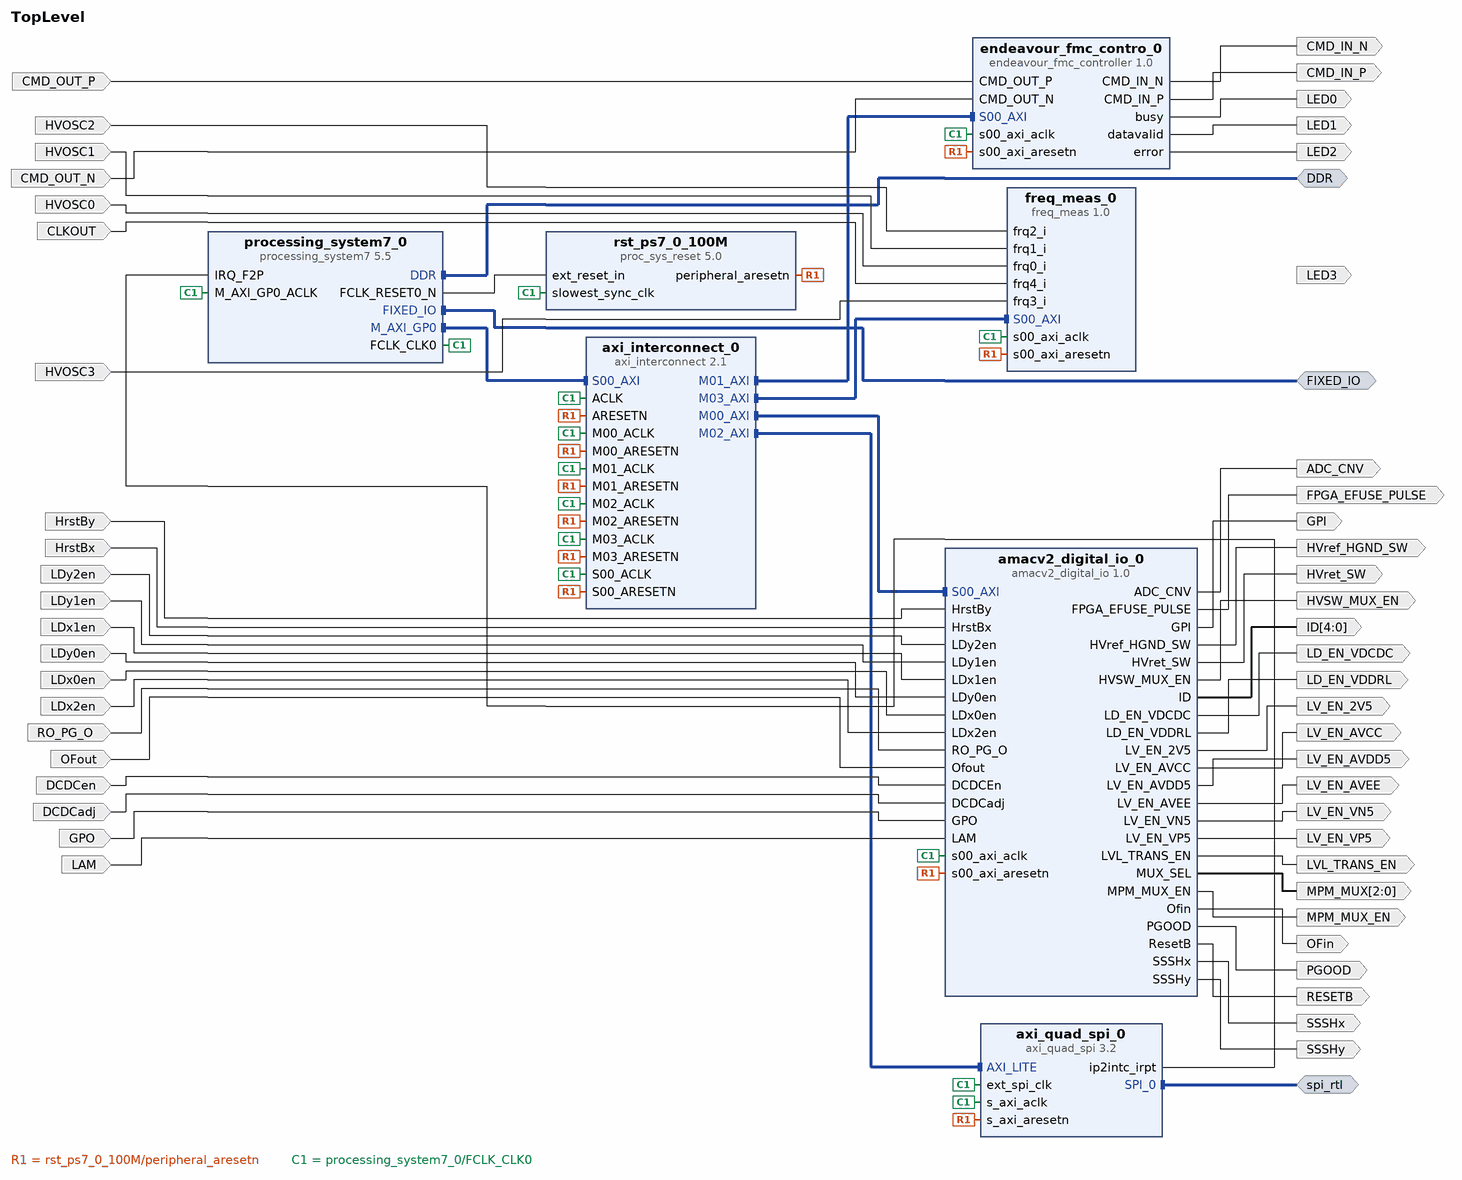
[diagram p0: block diagram of the top level]
# Vivado block design TopLevel, xc7z020clg400-1, Vivado 2018.2
create_bd_design TopLevel

create_bd_intf_port -mode Master -vlnv xilinx.com:interface:ddrx_rtl:1.0 DDR
create_bd_intf_port -mode Master -vlnv xilinx.com:display_processing_system7:fixedio_rtl:1.0 FIXED_IO
create_bd_intf_port -mode Master -vlnv xilinx.com:interface:spi_rtl:1.0 spi_rtl
create_bd_port -dir O LED3
create_bd_port -dir I HVOSC2
create_bd_port -dir I HVOSC1
create_bd_port -dir I HVOSC0
create_bd_port -dir I CLKOUT
create_bd_port -dir I HVOSC3
create_bd_port -dir I CMD_OUT_P
create_bd_port -dir I CMD_OUT_N
create_bd_port -dir O CMD_IN_P
create_bd_port -dir O CMD_IN_N
create_bd_port -dir O OFin
create_bd_port -dir O ADC_CNV
create_bd_port -dir O MPM_MUX_EN
create_bd_port -dir O -from 2 -to 0 MPM_MUX
create_bd_port -dir O HVSW_MUX_EN
create_bd_port -dir O LV_EN_AVCC
create_bd_port -dir O LV_EN_AVEE
create_bd_port -dir O LV_EN_AVDD5
create_bd_port -dir O LV_EN_VN5
create_bd_port -dir O LV_EN_VP5
create_bd_port -dir O LV_EN_2V5
create_bd_port -dir O -from 4 -to 0 ID
create_bd_port -dir O GPI
create_bd_port -dir O SSSHy
create_bd_port -dir I HrstBy
create_bd_port -dir I HrstBx
create_bd_port -dir I LDy2en
create_bd_port -dir I LDy1en
create_bd_port -dir I LDx1en
create_bd_port -dir I LDy0en
create_bd_port -dir O PGOOD
create_bd_port -dir I LDx0en
create_bd_port -dir I LDx2en
create_bd_port -dir O SSSHx
create_bd_port -dir O RESETB
create_bd_port -dir I RO_PG_O
create_bd_port -dir I OFout
create_bd_port -dir I DCDCen
create_bd_port -dir I DCDCadj
create_bd_port -dir I GPO
create_bd_port -dir I LAM
create_bd_port -dir O LD_EN_VDDRL
create_bd_port -dir O LD_EN_VDCDC
create_bd_port -dir O LVL_TRANS_EN
create_bd_port -dir O HVref_HGND_SW
create_bd_port -dir O HVret_SW
create_bd_port -dir O LED1
create_bd_port -dir O LED0
create_bd_port -dir O FPGA_EFUSE_PULSE
create_bd_port -dir O LED2

create_bd_cell -type ip -vlnv xilinx.com:ip:processing_system7:5.5 processing_system7_0
set_property -dict [list \
  CONFIG.PCW_APU_PERIPHERAL_FREQMHZ 667 \
  CONFIG.PCW_SDIO_PERIPHERAL_FREQMHZ 25 \
  CONFIG.PCW_UART_PERIPHERAL_FREQMHZ 50 \
  CONFIG.PCW_FPGA0_PERIPHERAL_FREQMHZ 100 \
  CONFIG.PCW_FPGA1_PERIPHERAL_FREQMHZ 40 \
  CONFIG.PCW_FPGA2_PERIPHERAL_FREQMHZ 33.333333 \
  CONFIG.PCW_USE_FABRIC_INTERRUPT 1 \
  CONFIG.PCW_IRQ_F2P_INTR 1 \
  CONFIG.PCW_PRESET_BANK1_VOLTAGE {LVCMOS 1.8V} \
  CONFIG.PCW_UIPARAM_DDR_PARTNO {MT41K256M16 RE-125} \
  CONFIG.PCW_QSPI_PERIPHERAL_ENABLE 1 \
  CONFIG.PCW_QSPI_QSPI_IO {MIO 1 .. 6} \
  CONFIG.PCW_QSPI_GRP_SINGLE_SS_ENABLE 1 \
  CONFIG.PCW_QSPI_GRP_SINGLE_SS_IO {MIO 1 .. 6} \
  CONFIG.PCW_SINGLE_QSPI_DATA_MODE x4 \
  CONFIG.PCW_QSPI_GRP_FBCLK_ENABLE 1 \
  CONFIG.PCW_QSPI_GRP_FBCLK_IO {MIO 8} \
  CONFIG.PCW_ENET0_PERIPHERAL_ENABLE 1 \
  CONFIG.PCW_ENET0_ENET0_IO {MIO 16 .. 27} \
  CONFIG.PCW_ENET0_GRP_MDIO_ENABLE 1 \
  CONFIG.PCW_ENET0_GRP_MDIO_IO {MIO 52 .. 53} \
  CONFIG.PCW_ENET_RESET_ENABLE 1 \
  CONFIG.PCW_ENET_RESET_SELECT {Share reset pin} \
  CONFIG.PCW_ENET0_RESET_ENABLE 0 \
  CONFIG.PCW_SD0_PERIPHERAL_ENABLE 1 \
  CONFIG.PCW_SD0_SD0_IO {MIO 40 .. 45} \
  CONFIG.PCW_SD0_GRP_CD_ENABLE 1 \
  CONFIG.PCW_SD0_GRP_CD_IO {MIO 46} \
  CONFIG.PCW_SD0_GRP_WP_ENABLE 1 \
  CONFIG.PCW_SD0_GRP_WP_IO {MIO 50} \
  CONFIG.PCW_UART1_PERIPHERAL_ENABLE 1 \
  CONFIG.PCW_UART1_UART1_IO {MIO 48 .. 49} \
  CONFIG.PCW_TTC0_PERIPHERAL_ENABLE 1 \
  CONFIG.PCW_TTC0_TTC0_IO EMIO \
  CONFIG.PCW_USB0_PERIPHERAL_ENABLE 1 \
  CONFIG.PCW_USB0_USB0_IO {MIO 28 .. 39} \
  CONFIG.PCW_USB_RESET_ENABLE 1 \
  CONFIG.PCW_USB_RESET_SELECT {Share reset pin} \
  CONFIG.PCW_USB0_RESET_ENABLE 1 \
  CONFIG.PCW_USB0_RESET_IO {MIO 7} \
  CONFIG.PCW_I2C_RESET_ENABLE 0 \
  CONFIG.PCW_GPIO_PERIPHERAL_ENABLE 1 \
  CONFIG.PCW_GPIO_MIO_GPIO_ENABLE 1 \
  CONFIG.PCW_GPIO_MIO_GPIO_IO MIO \
] [get_bd_cells processing_system7_0]
# 275 more settings of processing_system7_0 are not shown: defaults, MIO pin electricals, DDR timing, and values the tool derives
create_bd_cell -type ip -vlnv xilinx.com:ip:proc_sys_reset:5.0 rst_ps7_0_100M
create_bd_cell -type ip -vlnv xilinx.com:ip:axi_quad_spi:3.2 axi_quad_spi_0
set_property -dict [list \
  CONFIG.C_USE_STARTUP 0 \
  CONFIG.C_NUM_SS_BITS 8 \
  CONFIG.C_SCK_RATIO 4 \
  CONFIG.C_FIFO_DEPTH 16 \
  CONFIG.C_S_AXI4_ID_WIDTH 0 \
] [get_bd_cells axi_quad_spi_0]
create_bd_cell -type ip -vlnv xilinx.com:ip:axi_interconnect:2.1 axi_interconnect_0
set_property -dict {CONFIG.NUM_MI 4} [get_bd_cells axi_interconnect_0]
create_bd_cell -type ip -vlnv xilinx.com:user:amacv2_digital_io:1.0 amacv2_digital_io_0
create_bd_cell -type ip -vlnv lbl.gov:endeavour:endeavour_fmc_controller:1.0 endeavour_fmc_contro_0
create_bd_cell -type ip -vlnv user.org:user:freq_meas:1.0 freq_meas_0

# ---- connections ----

connect_bd_intf_net [get_bd_intf_pins processing_system7_0/M_AXI_GP0] [get_bd_intf_pins axi_interconnect_0/S00_AXI]
connect_bd_intf_net [get_bd_intf_pins axi_interconnect_0/M01_AXI] [get_bd_intf_pins endeavour_fmc_contro_0/S00_AXI]
connect_bd_intf_net [get_bd_intf_pins axi_interconnect_0/M02_AXI] [get_bd_intf_pins axi_quad_spi_0/AXI_LITE]
connect_bd_intf_net [get_bd_intf_pins axi_interconnect_0/M03_AXI] [get_bd_intf_pins freq_meas_0/S00_AXI]
connect_bd_intf_net [get_bd_intf_pins axi_interconnect_0/M00_AXI] [get_bd_intf_pins amacv2_digital_io_0/S00_AXI]
connect_bd_intf_net [get_bd_intf_ports DDR] [get_bd_intf_pins processing_system7_0/DDR]
connect_bd_intf_net [get_bd_intf_ports FIXED_IO] [get_bd_intf_pins processing_system7_0/FIXED_IO]
connect_bd_intf_net [get_bd_intf_ports spi_rtl] [get_bd_intf_pins axi_quad_spi_0/SPI_0]
connect_bd_net [get_bd_pins processing_system7_0/FCLK_RESET0_N] [get_bd_pins rst_ps7_0_100M/ext_reset_in]
connect_bd_net -net HVOSC2_0_1 [get_bd_ports HVOSC2] [get_bd_pins freq_meas_0/frq2_i]
connect_bd_net -net HVOSC1_0_1 [get_bd_ports HVOSC1] [get_bd_pins freq_meas_0/frq1_i]
connect_bd_net -net HVOSC0_0_1 [get_bd_ports HVOSC0] [get_bd_pins freq_meas_0/frq0_i]
connect_bd_net -net CLKOUT_0_1 [get_bd_ports CLKOUT] [get_bd_pins freq_meas_0/frq4_i]
connect_bd_net -net HVOSC3_0_1 [get_bd_ports HVOSC3] [get_bd_pins freq_meas_0/frq3_i]
connect_bd_net [get_bd_pins axi_quad_spi_0/ip2intc_irpt] [get_bd_pins processing_system7_0/IRQ_F2P]
connect_bd_net [get_bd_ports CMD_OUT_P] [get_bd_pins endeavour_fmc_contro_0/CMD_OUT_P]
connect_bd_net [get_bd_ports CMD_OUT_N] [get_bd_pins endeavour_fmc_contro_0/CMD_OUT_N]
connect_bd_net [get_bd_pins endeavour_fmc_contro_0/CMD_IN_P] [get_bd_ports CMD_IN_P]
connect_bd_net [get_bd_pins endeavour_fmc_contro_0/CMD_IN_N] [get_bd_ports CMD_IN_N]
connect_bd_net [get_bd_pins rst_ps7_0_100M/peripheral_aresetn] \
  [get_bd_pins axi_quad_spi_0/s_axi_aresetn] [get_bd_pins amacv2_digital_io_0/s00_axi_aresetn] \
  [get_bd_pins endeavour_fmc_contro_0/s00_axi_aresetn] [get_bd_pins axi_interconnect_0/S00_ARESETN] \
  [get_bd_pins axi_interconnect_0/ARESETN] [get_bd_pins axi_interconnect_0/M00_ARESETN] \
  [get_bd_pins axi_interconnect_0/M01_ARESETN] [get_bd_pins axi_interconnect_0/M02_ARESETN] \
  [get_bd_pins axi_interconnect_0/M03_ARESETN] [get_bd_pins freq_meas_0/s00_axi_aresetn]
connect_bd_net [get_bd_pins amacv2_digital_io_0/Ofin] [get_bd_ports OFin]
connect_bd_net [get_bd_pins amacv2_digital_io_0/ADC_CNV] [get_bd_ports ADC_CNV]
connect_bd_net [get_bd_pins amacv2_digital_io_0/MPM_MUX_EN] [get_bd_ports MPM_MUX_EN]
connect_bd_net [get_bd_pins amacv2_digital_io_0/MUX_SEL] [get_bd_ports MPM_MUX]
connect_bd_net [get_bd_pins amacv2_digital_io_0/HVSW_MUX_EN] [get_bd_ports HVSW_MUX_EN]
connect_bd_net [get_bd_pins amacv2_digital_io_0/LV_EN_AVCC] [get_bd_ports LV_EN_AVCC]
connect_bd_net [get_bd_pins amacv2_digital_io_0/LV_EN_AVEE] [get_bd_ports LV_EN_AVEE]
connect_bd_net [get_bd_pins amacv2_digital_io_0/LV_EN_AVDD5] [get_bd_ports LV_EN_AVDD5]
connect_bd_net [get_bd_pins amacv2_digital_io_0/LV_EN_VN5] [get_bd_ports LV_EN_VN5]
connect_bd_net [get_bd_pins amacv2_digital_io_0/LV_EN_VP5] [get_bd_ports LV_EN_VP5]
connect_bd_net [get_bd_pins amacv2_digital_io_0/LV_EN_2V5] [get_bd_ports LV_EN_2V5]
connect_bd_net [get_bd_pins amacv2_digital_io_0/ID] [get_bd_ports ID]
connect_bd_net [get_bd_pins amacv2_digital_io_0/GPI] [get_bd_ports GPI]
connect_bd_net [get_bd_pins amacv2_digital_io_0/SSSHy] [get_bd_ports SSSHy]
connect_bd_net [get_bd_ports HrstBy] [get_bd_pins amacv2_digital_io_0/HrstBy]
connect_bd_net [get_bd_ports HrstBx] [get_bd_pins amacv2_digital_io_0/HrstBx]
connect_bd_net [get_bd_ports LDy2en] [get_bd_pins amacv2_digital_io_0/LDy2en]
connect_bd_net [get_bd_ports LDy1en] [get_bd_pins amacv2_digital_io_0/LDy1en]
connect_bd_net [get_bd_ports LDx1en] [get_bd_pins amacv2_digital_io_0/LDx1en]
connect_bd_net [get_bd_ports LDy0en] [get_bd_pins amacv2_digital_io_0/LDy0en]
connect_bd_net [get_bd_pins amacv2_digital_io_0/PGOOD] [get_bd_ports PGOOD]
connect_bd_net [get_bd_ports LDx0en] [get_bd_pins amacv2_digital_io_0/LDx0en]
connect_bd_net [get_bd_ports LDx2en] [get_bd_pins amacv2_digital_io_0/LDx2en]
connect_bd_net [get_bd_pins amacv2_digital_io_0/SSSHx] [get_bd_ports SSSHx]
connect_bd_net [get_bd_pins amacv2_digital_io_0/ResetB] [get_bd_ports RESETB]
connect_bd_net [get_bd_ports RO_PG_O] [get_bd_pins amacv2_digital_io_0/RO_PG_O]
connect_bd_net [get_bd_ports OFout] [get_bd_pins amacv2_digital_io_0/Ofout]
connect_bd_net [get_bd_ports DCDCen] [get_bd_pins amacv2_digital_io_0/DCDCEn]
connect_bd_net [get_bd_ports DCDCadj] [get_bd_pins amacv2_digital_io_0/DCDCadj]
connect_bd_net [get_bd_ports GPO] [get_bd_pins amacv2_digital_io_0/GPO]
connect_bd_net [get_bd_ports LAM] [get_bd_pins amacv2_digital_io_0/LAM]
connect_bd_net [get_bd_pins amacv2_digital_io_0/LD_EN_VDDRL] [get_bd_ports LD_EN_VDDRL]
connect_bd_net [get_bd_pins amacv2_digital_io_0/LD_EN_VDCDC] [get_bd_ports LD_EN_VDCDC]
connect_bd_net [get_bd_pins amacv2_digital_io_0/LVL_TRANS_EN] [get_bd_ports LVL_TRANS_EN]
connect_bd_net [get_bd_pins amacv2_digital_io_0/HVref_HGND_SW] [get_bd_ports HVref_HGND_SW]
connect_bd_net [get_bd_pins amacv2_digital_io_0/HVret_SW] [get_bd_ports HVret_SW]
connect_bd_net [get_bd_pins endeavour_fmc_contro_0/datavalid] [get_bd_ports LED1]
connect_bd_net [get_bd_pins endeavour_fmc_contro_0/busy] [get_bd_ports LED0]
connect_bd_net [get_bd_pins amacv2_digital_io_0/FPGA_EFUSE_PULSE] [get_bd_ports FPGA_EFUSE_PULSE]
connect_bd_net [get_bd_pins endeavour_fmc_contro_0/error] [get_bd_ports LED2]
connect_bd_net [get_bd_pins processing_system7_0/FCLK_CLK0] \
  [get_bd_pins processing_system7_0/M_AXI_GP0_ACLK] [get_bd_pins rst_ps7_0_100M/slowest_sync_clk] \
  [get_bd_pins axi_quad_spi_0/ext_spi_clk] [get_bd_pins axi_quad_spi_0/s_axi_aclk] \
  [get_bd_pins amacv2_digital_io_0/s00_axi_aclk] [get_bd_pins endeavour_fmc_contro_0/s00_axi_aclk] \
  [get_bd_pins axi_interconnect_0/S00_ACLK] [get_bd_pins axi_interconnect_0/M02_ACLK] [get_bd_pins axi_interconnect_0/ACLK] \
  [get_bd_pins axi_interconnect_0/M00_ACLK] [get_bd_pins axi_interconnect_0/M01_ACLK] \
  [get_bd_pins axi_interconnect_0/M03_ACLK] [get_bd_pins freq_meas_0/s00_axi_aclk]

# ---- address map ----
assign_bd_address -offset 0x41E00000 -range 64K -target_address_space [get_bd_addr_spaces processing_system7_0/Data] [get_bd_addr_segs axi_quad_spi_0/AXI_LITE/Reg]
assign_bd_address -offset 0x43C00000 -range 64K -target_address_space [get_bd_addr_spaces processing_system7_0/Data] [get_bd_addr_segs endeavour_fmc_contro_0/S00_AXI/S00_AXI_reg]
assign_bd_address -offset 0x43C10000 -range 64K -target_address_space [get_bd_addr_spaces processing_system7_0/Data] [get_bd_addr_segs amacv2_digital_io_0/S00_AXI/S00_AXI_reg]
assign_bd_address -offset 0x43C20000 -range 64K -target_address_space [get_bd_addr_spaces processing_system7_0/Data] [get_bd_addr_segs freq_meas_0/S00_AXI/S00_AXI_reg]

validate_bd_design
save_bd_design
